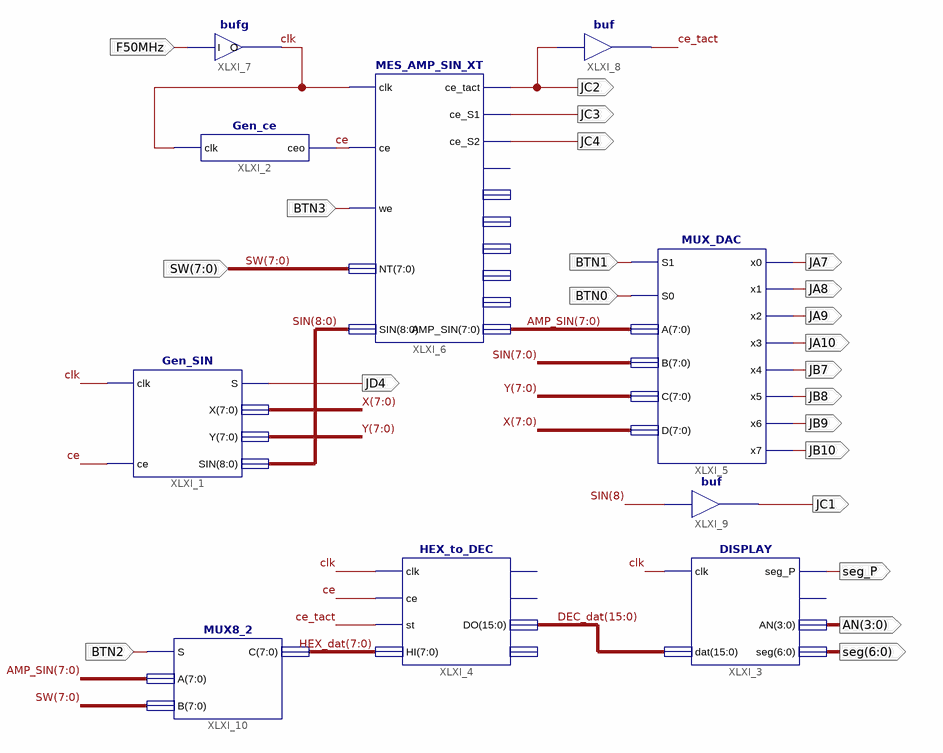
[diagram p0: schematic sheet 1]
// Xilinx ISE schematic Sch_Lab410_XT_V1.sch (spartan3e) as structural Verilog: 10 symbols, 22 ports
module Sch_Lab410_XT_V1 (
  input  F50MHz,
  input  BTN3,
  input  [7:0] SW,
  input  BTN1,
  input  BTN0,
  input  BTN2,
  output JC3,
  output JC4,
  output JC2,
  output JA7,
  output JA8,
  output JA9,
  output JA10,
  output JB7,
  output JB8,
  output JB9,
  output JB10,
  output JD4,
  output JC1,
  output seg_P,
  output [3:0] AN,
  output [6:0] seg
);

  wire ce, ce_tact, clk;
  wire [7:0] AMP_SIN, HEX_dat, X, Y;
  wire [8:0] SIN;
  wire [15:0] DEC_dat;

  Gen_SIN XLXI_1 (.clk(clk), .ce(ce), .S(JD4), .X(X), .Y(Y), .SIN(SIN));
  Gen_ce XLXI_2 (.clk(clk), .ceo(ce));
  DISPLAY XLXI_3 (.clk(clk), .dat(DEC_dat), .seg_P(seg_P), .AN(AN), .seg(seg));  // open: ce1ms
  HEX_to_DEC XLXI_4 (.clk(clk), .ce(ce), .st(ce_tact), .HI(HEX_dat), .DO(DEC_dat));  // open: ok_conv, en_conv, ptr_dig
  MUX_DAC XLXI_5 (
    .S1(BTN1), .S0(BTN0), .A(AMP_SIN), .B(SIN[7:0]), .C(Y), .D(X), .x0(JA7), .x1(JA8), .x2(JA9), .x3(JA10),
    .x4(JB7), .x5(JB8), .x6(JB9), .x7(JB10));
  MES_AMP_SIN_XT XLXI_6 (
    .clk(clk), .ce(ce), .we(BTN3), .NT(SW), .SIN(SIN), .ce_tact(JC2), .ce_S1(JC3), .ce_S2(JC4),
    .AMP_SIN(AMP_SIN));  // open: ok_SQ, S1, S2, mod_S1, mod_S2, AMP_QV
  bufg XLXI_7 (.I(F50MHz), .O(clk));
  buf XLXI_8 (ce_tact, JC2);
  buf XLXI_9 (JC1, SIN[8]);
  MUX8_2 XLXI_10 (.S(BTN2), .A(AMP_SIN), .B(SW), .C(HEX_dat));
endmodule
